# EAGLE design electricals_with_iPod (EAGLE 6.5.0)
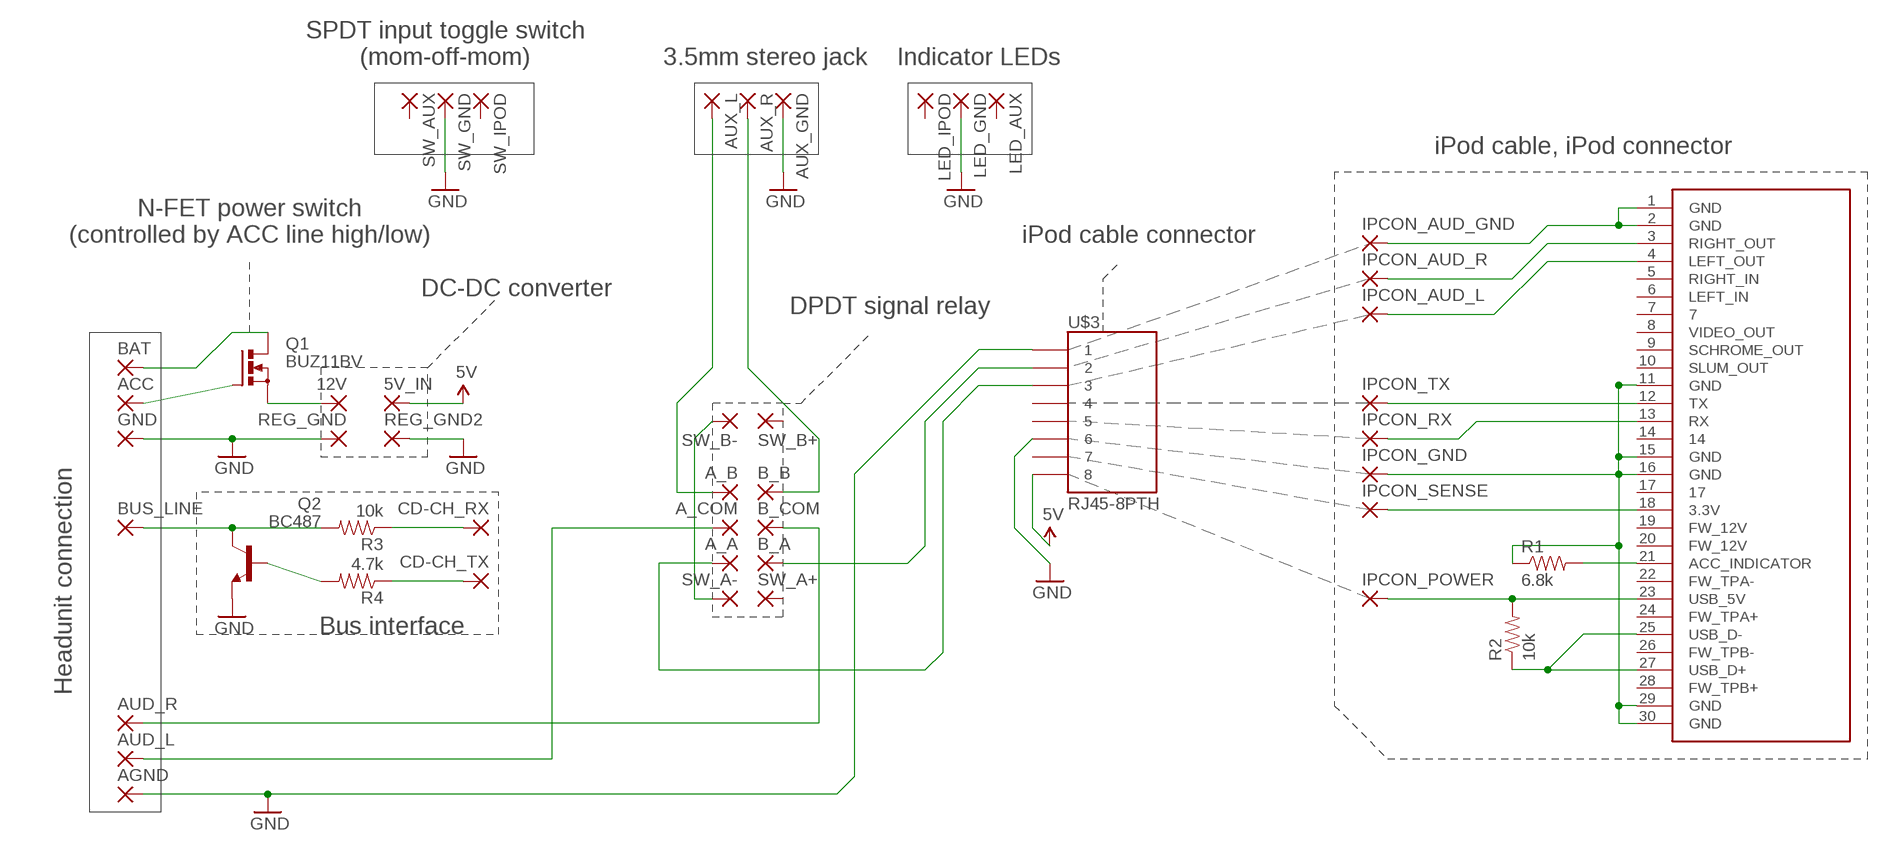
[diagram p0: schematic, sheet 1]

## Parts
5V_IN  2,54/1,1  [2,54/1,1]
12V  2,54/1,1  [2,54/1,1]
A_A  1,6/0,9  [1,6/0,9]
A_B  1,6/0,9  [1,6/0,9]
A_COM  1,6/0,9  [1,6/0,9]
ACC  1,6/0,9  [1,6/0,9]
AGND  1,6/0,9  [1,6/0,9]
AUD_L  1,6/0,9  [1,6/0,9]
AUD_R  1,6/0,9  [1,6/0,9]
AUX_GND  1,6/0,9  [1,6/0,9]
AUX_L  1,6/0,9  [1,6/0,9]
AUX_R  1,6/0,9  [1,6/0,9]
B_A  1,6/0,9  [1,6/0,9]
B_B  1,6/0,9  [1,6/0,9]
B_COM  1,6/0,9  [1,6/0,9]
BAT  2,54/1,1  [2,54/1,1]
BUS_LINE  1,6/0,9  [1,6/0,9]
CD-CH_RX  1,6/0,9  [1,6/0,9]
CD-CH_TX  1,6/0,9  [1,6/0,9]
GND  2,54/1,1  [2,54/1,1]
IPCON_AUD_GND  1,6/0,9  [1,6/0,9]
IPCON_AUD_L  1,6/0,9  [1,6/0,9]
IPCON_AUD_R  1,6/0,9  [1,6/0,9]
IPCON_GND  1,6/0,9  [1,6/0,9]
IPCON_POWER  1,6/0,9  [1,6/0,9]
IPCON_RX  1,6/0,9  [1,6/0,9]
IPCON_SENSE  1,6/0,9  [1,6/0,9]
IPCON_TX  1,6/0,9  [1,6/0,9]
LED_AUX  1,6/0,9  [1,6/0,9]
LED_GND  1,6/0,9  [1,6/0,9]
LED_IPOD  1,6/0,9  [1,6/0,9]
Q1  BUZ11BV  [TO220BV]
Q2  BC487  [TO92-EBC]
R1  6.8k  RESISTOR1206  [1206]
R2  10k  RESISTOR1206  [1206]
R3  10k  RESISTOR1206  [1206]
R4  4.7k  RESISTOR1206  [1206]
REG_GND  2,54/1,1  [2,54/1,1]
REG_GND2  2,54/1,1  [2,54/1,1]
SW_A+  1,6/0,9  [1,6/0,9]
SW_A-  1,6/0,9  [1,6/0,9]
SW_AUX  1,6/0,9  [1,6/0,9]
SW_B+  1,6/0,9  [1,6/0,9]
SW_B-  1,6/0,9  [1,6/0,9]
SW_GND  1,6/0,9  [1,6/0,9]
SW_IPOD  1,6/0,9  [1,6/0,9]
U$1  IPOD_CONNECTOR_MALE  [IPOD_MALE_CONNECTOR]
U$3  RJ45-8PTH  [RJ45-8]

## Nets
5V: 5V_IN.1(P) U$3.8
GND: AGND.1(P) AUX_GND.1(P) GND.1(P) LED_GND.1(P) Q2.E REG_GND2.1(P) REG_GND.1(P) SW_GND.1(P) U$3.1 U$3.6
N$1: ACC.1(P) Q1.G
N$2: BAT.1(P) Q1.D
N$3: 12V.1(P) Q1.S
N$4: IPCON_POWER.1(P) R2.2 U$1.23(USB_5V)
N$5: IPCON_AUD_GND.1(P) U$1.1(GND) U$1.2(GND)
N$6: IPCON_SENSE.1(P) U$1.18(3.3V)
N$7: IPCON_RX.1(P) U$1.13(RX)
N$8: IPCON_TX.1(P) U$1.12(TX)
N$9: IPCON_AUD_R.1(P) U$1.3(RIGHT_OUT)
N$10: IPCON_AUD_L.1(P) U$1.4(LEFT_OUT)
N$11: R2.1 U$1.25(USB_D-) U$1.27(USB_D+)
N$12: IPCON_GND.1(P) R1.1 U$1.11(GND) U$1.15(GND) U$1.16(GND) U$1.29(GND) U$1.30(GND)
N$13: R1.2 U$1.21(ACC_INDICATOR)
N$14: SW_A-.1(P) SW_B-.1(P)
N$15: A_COM.1(P) AUD_L.1(P)
N$16: AUD_R.1(P) B_COM.1(P)
N$17: A_B.1(P) AUX_L.1(P)
N$18: AUX_R.1(P) B_B.1(P)
N$19: BUS_LINE.1(P) Q2.C R3.2
N$20: Q2.B R4.2
N$21: CD-CH_RX.1(P) R3.1
N$22: CD-CH_TX.1(P) R4.1
N$23: B_A.1(P) U$3.2
N$24: A_A.1(P) U$3.3
Unconnected: LED_AUX.1(P) LED_IPOD.1(P) SW_A+.1(P) SW_AUX.1(P) SW_B+.1(P) SW_IPOD.1(P) U$1.5(RIGHT_IN) U$1.6(LEFT_IN) U$1.7 U$1.8(VIDEO_OUT) U$1.9(SCHROME_OUT) U$1.10(SLUM_OUT) U$1.14 U$1.17 U$1.19(FW_12V) U$1.20(FW_12V) U$1.22(FW_TPA-) U$1.24(FW_TPA+) U$1.26(FW_TPB-) U$1.28(FW_TPB+) U$3.4 U$3.5 U$3.7

## Notes on the sheet
- SPDT input toggle switch
  (mom-off-mom)
- 3.5mm stereo jack | Indicator LEDs
- iPod cable, iPod connector
- N-FET power switch
  (controlled by ACC line high/low)
- iPod cable connector
- DC-DC converter
- DPDT signal relay
- Headunit connection
- Bus interface

## Library data of the parts
5V_IN 12V BAT GND REG_GND REG_GND2 = wirepad:2,54/1,1: THROUGH-HOLE PAD
A_A A_B A_COM ACC AGND AUD_L AUD_R AUX_GND AUX_L AUX_R B_A B_B B_COM BUS_LINE CD-CH_RX CD-CH_TX IPCON_AUD_GND IPCON_AUD_L IPCON_AUD_R IPCON_GND IPCON_POWER IPCON_RX IPCON_SENSE IPCON_TX LED_AUX LED_GND LED_IPOD SW_A+ SW_A- SW_AUX SW_B+ SW_B- SW_GND SW_IPOD = wirepad:1,6/0,9: THROUGH-HOLE PAD
Q1 = transistor-power:BUZ11: N-CHANNEL MOS FET
Q2 = transistor-npn:BC487*: NPN Transistor
R1-R4 = SparkFun-Resistors:RESISTOR: Resistor Basic schematic elements and footprints for 0603, 1206, and PTH resistors.
U$1 = SparkFun:IPOD_CONNECTOR_MALE: iPod Male Connector This is the connector that will insert into an iPods. Use this connector to gain access to the various iPod pins. Schematic and footprint are not yet production proven. The PCB thickness must be more thin than the standard 0.062" FR4. Spark Fun Electronics SKU : DEV-00633
U$3 = SparkFun-Connectors:RJ45-8: RJ45 Jack Simple RJ45, 8-pin connection - connector for common Cat5, Cat5e, and Cat6 Ethernet cables. Footprint not yet proven in production. Connector sku is PRT-00643; Breakout PCB sku is BOB-00716.

## Board
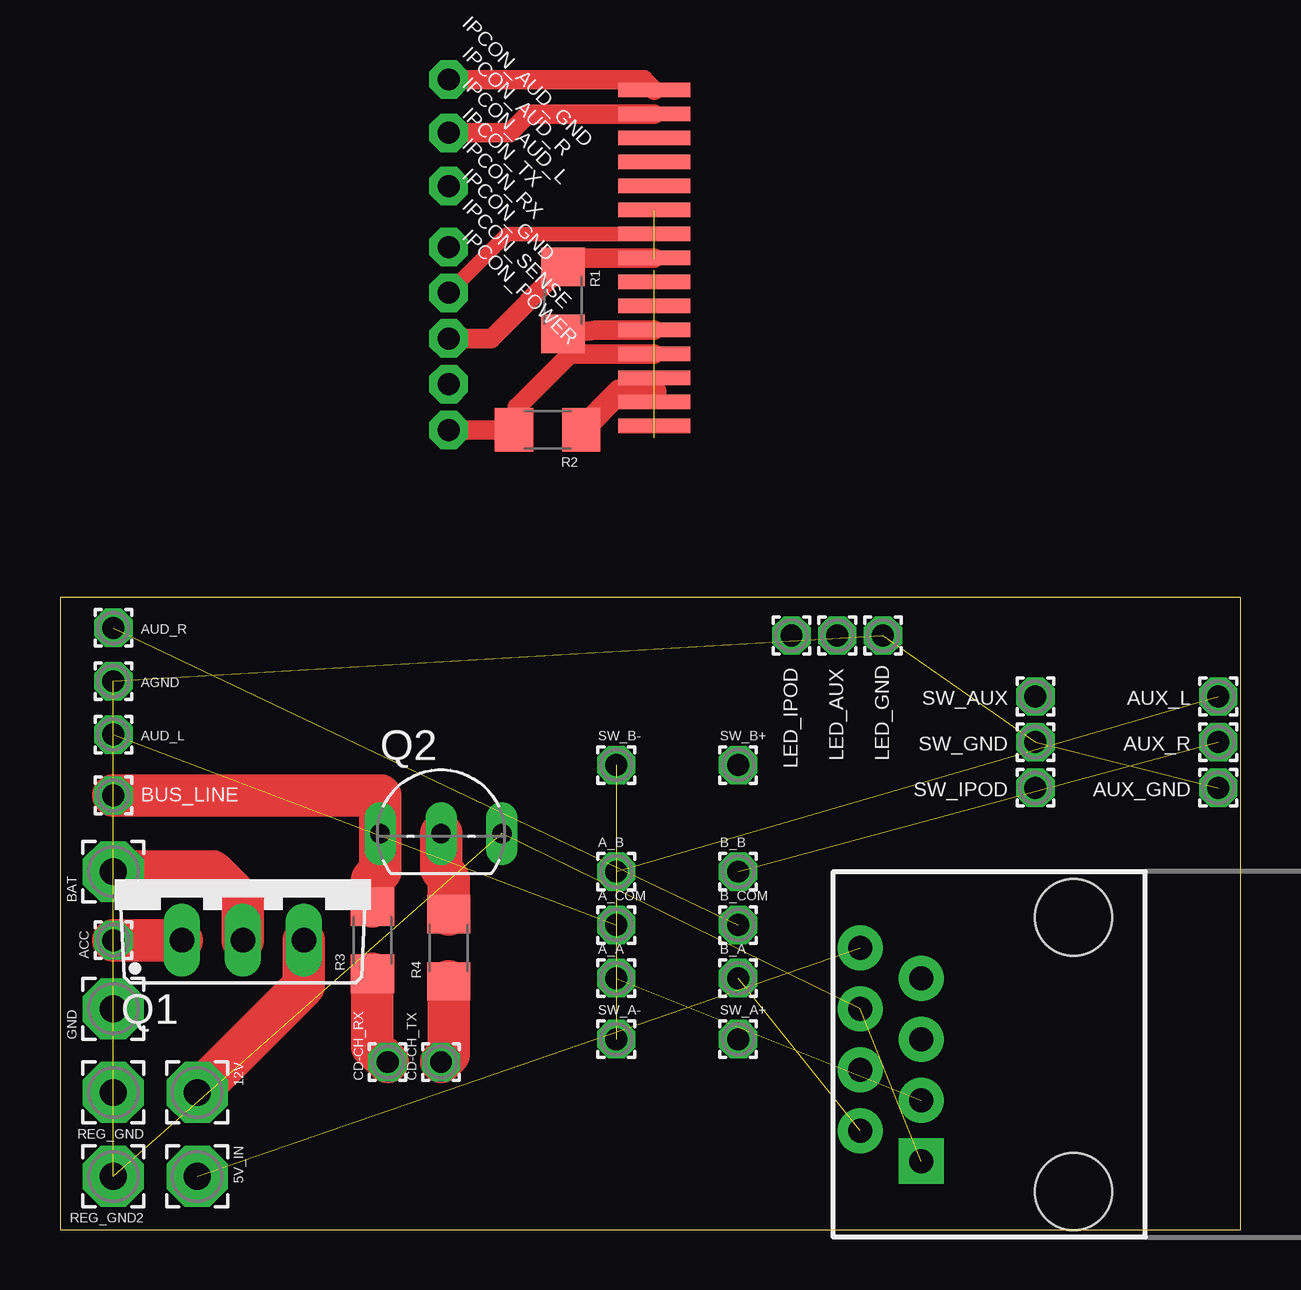
[diagram p1: board, top side]
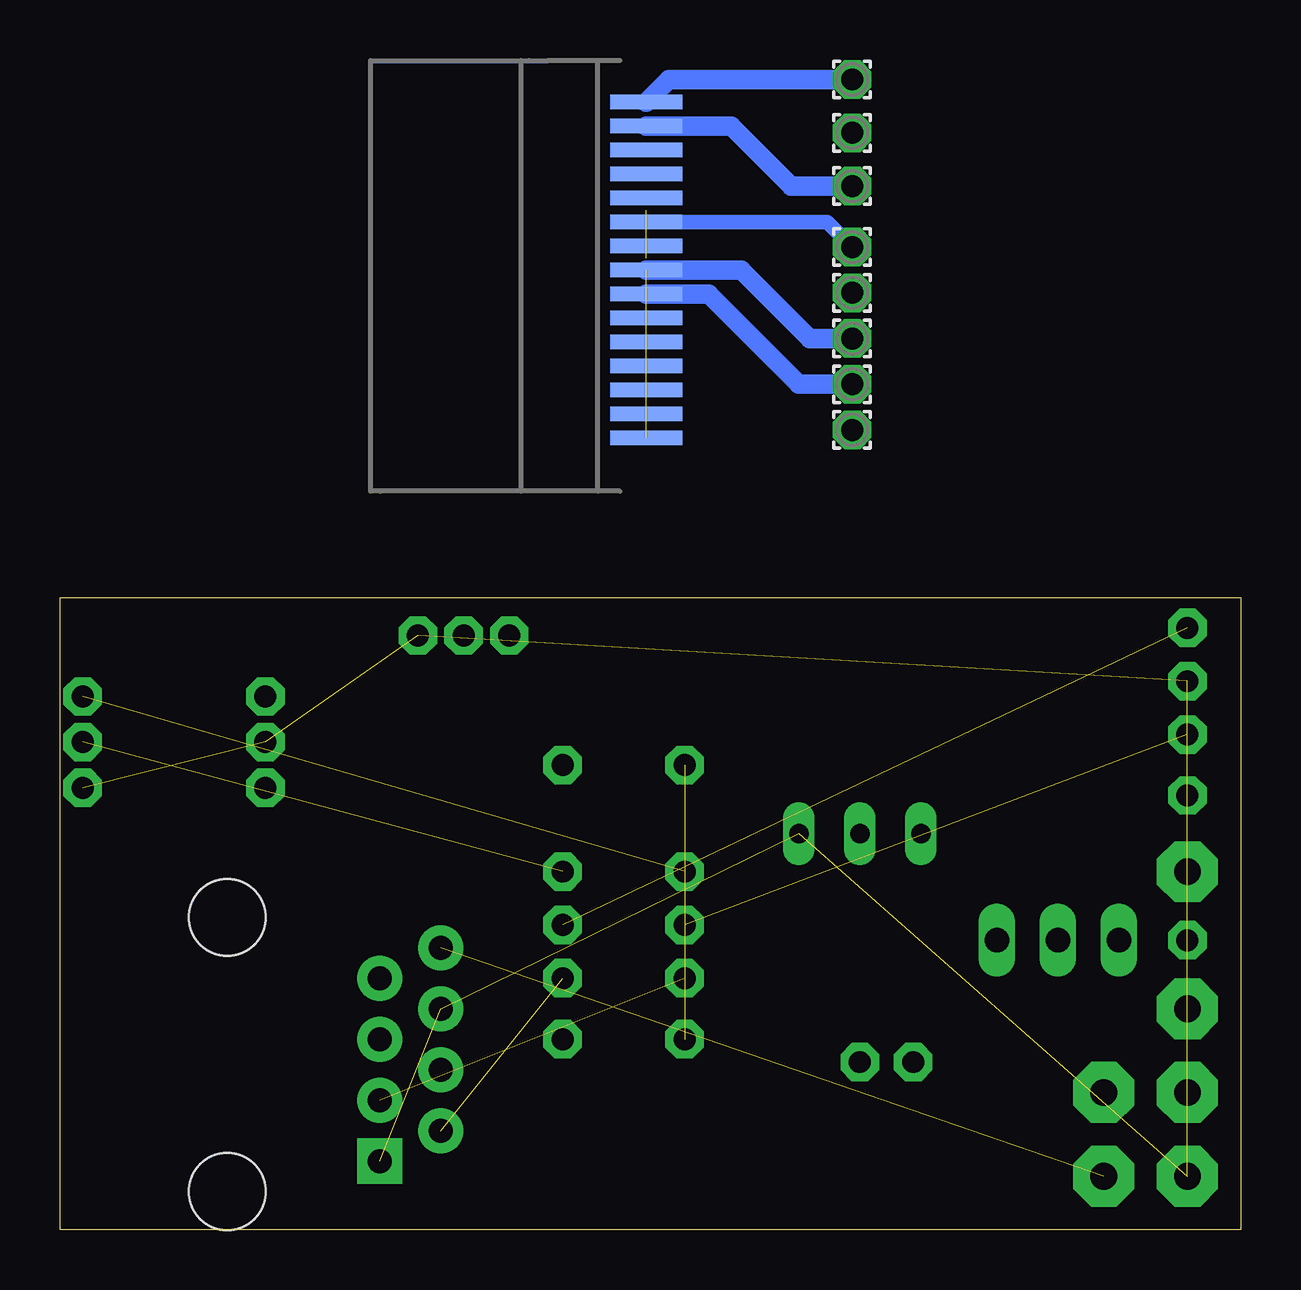
[diagram p2: board, bottom side, seen from below]

Size 49.2 x 26.34 mm. Coordinates in mm from the lower left corner, seen from the top.
Outline: 0,0 49.2,0 49.2,26.34 0,26.34 0,0
Copper layers (1*16): Top 0.035mm / dielectric 1.5mm / Bottom 0.035mm
Design rules "default": minimum track width 10mil, minimum drill 24mil, track to track 8mil, track to pad 8mil, pad to pad 8mil, via to via 8mil, smd to smd 8mil, copper to edge 40mil, drill to drill 8mil, minimum pad ring 10mil, minimum via ring 8mil, stop-mask expansion 4mil, vias tented up to drill 0mil, thermal gap 10mil

### Footprints (pad centres in the part's own frame; a part is rotated, then mirrored left to right if it is on the bottom)
2,54/1,1 = drill 1.118 pad 2.54 octagon: 1 0,0
1,6/0,9 = drill 0.914 pad 1.6 octagon: 1 0,0
TO220BV = drill 1.016 long: D 0,-2.54; G -2.54,-2.54; S 2.54,-2.54
TO92-EBC = drill 0.813 long: B 0,-1.27; C -2.54,-1.27; E 2.54,-1.27
1206 = smd 1.6 x 1.8: 1 -1.4,0; 2 1.4,0
IPOD_MALE_CONNECTOR = smd 0.6 x 3 bottom: 1 7.5,0; 3 6.5,0; 5 5.5,0; 7 4.5,0; 9 3.5,0; 11 2.5,0; 13 1.5,0; 15 0.5,0; 17 -0.5,0; 19 -1.5,0; 21 -2.5,0; 23 -3.5,0; 25 -4.5,0; 27 -5.5,0; 29 -6.5,0 | smd 0.6 x 3: 2 7,0; 4 6,0; 6 5,0; 8 4,0; 10 3,0; 12 2,0; 14 1,0; 16 0,0; 18 -1,0; 20 -2,0; 22 -3,0; 24 -4,0; 26 -5,0; 28 -6,0; 30 -7,0
RJ45-8 = drill 1 pad 1.88 square: 1 -4.445,6.35 | drill 1 pad 1.88: 2 -3.175,8.89; 3 -1.905,6.35; 4 -0.635,8.89; 5 0.635,6.35; 6 1.905,8.89; 7 3.175,6.35; 8 4.445,8.89 | hole 3.2: -5.715,0; 5.715,0

### Placement (x,y rotation side)
5V_IN  5.71,2.22 270 top
12V  5.71,5.71 270 top
A_A  23.18,10.48 0 top
A_B  23.18,14.92 0 top
A_COM  23.18,12.7 0 top
ACC  2.22,12.06 90 top
AGND  2.22,22.86 90 top
AUD_L  2.22,20.64 90 top
AUD_R  2.22,25.08 90 top
AUX_GND  48.26,18.41 180 top
AUX_L  48.26,22.23 180 top
AUX_R  48.26,20.32 180 top
B_A  28.26,10.48 0 top
B_B  28.26,14.92 0 top
B_COM  28.26,12.7 0 top
BAT  2.22,14.92 90 top
BUS_LINE  2.22,18.1 0 top
CD-CH_RX  13.65,6.99 90 top
CD-CH_TX  15.88,6.99 90 top
GND  2.22,9.21 90 top
IPCON_AUD_GND  16.19,47.94 0 bottom  (outside the outline)
IPCON_AUD_L  16.19,43.5 0 bottom  (outside the outline)
IPCON_AUD_R  16.19,45.72 0 bottom  (outside the outline)
IPCON_GND  16.19,37.15 0 bottom  (outside the outline)
IPCON_POWER  16.19,33.34 0 bottom  (outside the outline)
IPCON_RX  16.19,39.05 0 bottom  (outside the outline)
IPCON_SENSE  16.19,35.24 0 bottom  (outside the outline)
IPCON_TX  16.19,40.96 0 bottom  (outside the outline)
LED_AUX  32.38,24.77 0 top
LED_GND  34.29,24.77 0 top
LED_IPOD  30.48,24.77 90 top
Q1  7.62,14.61 0 top
Q2  15.88,17.78 0 top
R1  20.95,38.73 270 top  (outside the outline)
R2  20.32,33.34 180 top  (outside the outline)
R3  13.02,12.06 90 top
R4  16.19,11.75 90 top
REG_GND  2.22,5.71 180 top
REG_GND2  2.22,2.22 180 top
SW_A+  28.26,7.94 0 top
SW_A-  23.18,7.94 0 top
SW_AUX  40.64,22.23 180 top
SW_B+  28.26,19.37 0 top
SW_B-  23.18,19.37 0 top
SW_GND  40.64,20.32 180 top
SW_IPOD  40.64,18.41 180 top
U$1  24.77,40.01 90 bottom  (outside the outline)
U$3  42.23,7.3 90 top

### Tracks (layer width: path | path; a pad name or v marks a point on that pad's centre or on a via)
5V  (1 unrouted)
GND  (9 unrouted)
N$1
  Top 1.778: ACC.1 Q1.G
N$2
  Top 1.778: BAT.1 6.35,14.92 7.62,13.65 Q1.D
N$3
  Top 1.778: Q1.S 10.16,10.16 12V.1
N$4
  Top 0.61: 19.05,33.15 R2.2
  Top 0.813: U$1.23 21.27,36.51 19.05,34.29 19.05,33.15 | IPCON_POWER.1 R2.2
N$5
  Top 0.813: IPCON_AUD_GND.1 24.33,47.94 U$1.1
  Bottom 0.813: U$1.2 23.83,47.94 IPCON_AUD_GND.1
N$6
  Bottom 0.813: IPCON_SENSE.1 18.41,35.24 22.18,39.01 U$1.18
N$7
  Top 0.61: U$1.13 18.64,41.51 IPCON_RX.1
N$8
  Bottom 0.61: U$1.12 17.24,42.01 IPCON_TX.1
N$9
  Top 0.813: IPCON_AUD_R.1 18.73,45.72 19.52,46.51 U$1.3
N$10
  Bottom 0.813: U$1.4 21.24,46.01 18.73,43.5 IPCON_AUD_L.1
N$11
  Top 0.61: U$1.25 24.77,34.92 U$1.27
  Top 1.016: R2.1 23.31,34.92 24.77,34.92
N$12  (3 unrouted)
  Top 0.813: IPCON_GND.1 17.97,37.15 R1.1 21.32,40.51 U$1.15
  Bottom 0.813: U$1.16 20.82,40.01 17.97,37.15 IPCON_GND.1
N$13
  Top 0.813: U$1.21 22.32,37.51 R1.2
N$14  (1 unrouted)
N$15  (1 unrouted)
N$16  (1 unrouted)
N$17  (1 unrouted)
N$18  (1 unrouted)
N$19
  Top 1.778: R3.2 13.02,14.61 13.34,14.92 Q2.C 13.34,18.1 BUS_LINE.1
N$20
  Top 1.778: Q2.B 15.88,15.05 16.19,14.61 R4.2
N$21
  Top 1.778: R3.1 13.02,7.62 CD-CH_RX.1
N$22
  Top 1.778: R4.1 16.19,7.3 CD-CH_TX.1
N$23  (1 unrouted)
N$24  (1 unrouted)